# Altium project Due_Breakout_Board.PrjPcb
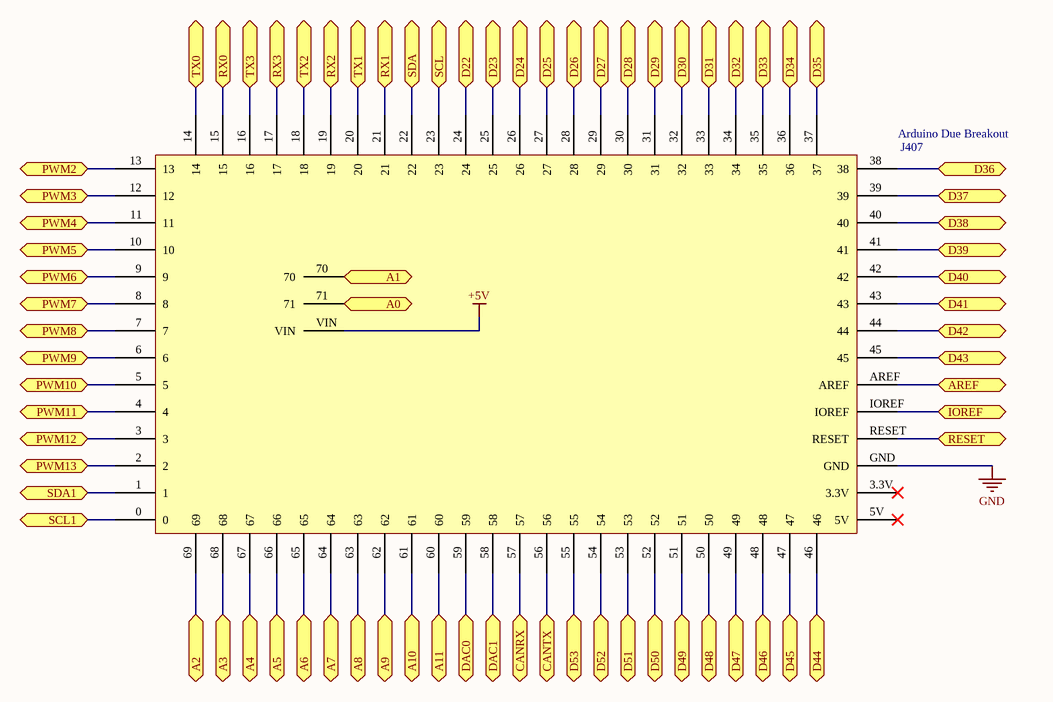
[diagram p0: Due_Breakout_Board.SchDoc]
3 sheets, 39 parts. Net scope: flat (ports and power ports of the same name join across sheets).
Board file: Due_Breakout_Board.PcbDoc
Sheets:
  Due_Breakout_Board.SchDoc
  Due_Breakout_Board Headers.SchDoc
  Due_Breakout_Board supporting circuits.SchDoc

## Sheet Due_Breakout_Board.SchDoc: Due Breakout Board
size A; DocumentNumber: 1; SheetNumber: 1; SheetTotal: 3

### Parts
J407  Arduino Due Breakout  [DUE_BREAKOUT]

### Ports
A0, A1, A2, A3, A4, A5, A6, A7, A8, A9, A10, A11, AREF, CANRX, CANTX, D22, D23, D24, D25, D26, D27, D28, D29, D30, D31, D32, D33, D34, D35, D36, D37, D38, D39, D40, D41, D42, D43, D44, D45, D46, D47, D48, D49, D50, D51, D52, D53, DAC0, DAC1, IOREF, PWM2, PWM3, PWM4, PWM5, PWM6, PWM7, PWM8, PWM9, PWM10, PWM11, PWM12, PWM13, RESET, RX0, RX1, RX2, RX3, SCL, SCL1, SDA, SDA1, TX0, TX1, TX2, TX3

### Nets
+5V: J407.VIN
GND: J407.GND
NetJ401_1: J407.24 ; port D22
NetJ401_2: J407.25 ; port D23
NetJ401_3: J407.26 ; port D24
NetJ401_4: J407.27 ; port D25
NetJ401_5: J407.28 ; port D26
NetJ401_6: J407.29 ; port D27
NetJ401_7: J407.31 ; port D29
NetJ401_8: J407.30 ; port D28
NetJ401_9: J407.71 ; port A0
NetJ401_10: J407.70 ; port A1
NetJ403_3: J407.41 ; port D39
NetJ403_4: J407.42 ; port D40
NetJ403_5: J407.43 ; port D41
NetJ403_6: J407.44 ; port D42
NetJ403_7: J407.45 ; port D43
NetJ403_8: J407.46 ; port D44
NetJ403_9: J407.47 ; port D45
NetJ403_10: J407.48 ; port D46
NetJ403_11: J407.49 ; port D47
NetJ403_12: J407.50 ; port D48
NetJ403_13: J407.51 ; port D49
NetJ403_14: J407.52 ; port D50
NetJ404_1: J407.62 ; port A9
NetJ404_2: J407.61 ; port A10
NetJ404_3: J407.60 ; port A11
NetJ404_4: J407.20 ; port TX1
NetJ404_6: J407.21 ; port RX1
NetJ404_7: J407.64 ; port A7
NetJ404_8: J407.63 ; port A8
NetJ404_10: J407.10 ; port PWM5
NetJ404_11: J407.9 ; port PWM6
NetJ404_12: J407.8 ; port PWM7
NetJ404_13: J407.7 ; port PWM8
NetJ404_14: J407.6 ; port PWM9
NetJ404_15: J407.5 ; port PWM10
NetJ404_16: J407.4 ; port PWM11
NetJ404_17: J407.3 ; port PWM12
NetJ407_0: J407.0 ; port SCL1
NetJ407_1: J407.1 ; port SDA1
NetJ407_2: J407.2 ; port PWM13
NetJ407_11: J407.11 ; port PWM4
NetJ407_12: J407.12 ; port PWM3
NetJ407_13: J407.13 ; port PWM2
NetJ407_14: J407.14 ; port TX0
NetJ407_15: J407.15 ; port RX0
NetJ407_16: J407.16 ; port TX3
NetJ407_17: J407.17 ; port RX3
NetJ407_18: J407.18 ; port TX2
NetJ407_19: J407.19 ; port RX2
NetJ407_22: J407.22 ; port SDA
NetJ407_23: J407.23 ; port SCL
NetJ407_32: J407.32 ; port D30
NetJ407_33: J407.33 ; port D31
NetJ407_34: J407.34 ; port D32
NetJ407_35: J407.35 ; port D33
NetJ407_36: J407.36 ; port D34
NetJ407_37: J407.37 ; port D35
NetJ407_38: J407.38 ; port D36
NetJ407_39: J407.39 ; port D37
NetJ407_40: J407.40 ; port D38
NetJ407_53: J407.53 ; port D51
NetJ407_54: J407.54 ; port D52
NetJ407_55: J407.55 ; port D53
NetJ407_56: J407.56 ; port CANTX
NetJ407_57: J407.57 ; port CANRX
NetJ407_58: J407.58 ; port DAC1
NetJ407_59: J407.59 ; port DAC0
NetJ407_65: J407.65 ; port A6
NetJ407_66: J407.66 ; port A5
NetJ407_67: J407.67 ; port A4
NetJ407_68: J407.68 ; port A3
NetJ407_69: J407.69 ; port A2
NetJ407_AREF: J407.AREF ; port AREF
NetJ407_IOREF: J407.IOREF ; port IOREF
NetJ407_RESET: J407.RESET ; port RESET

Not connected (* = marked no-connect by the designer): J407 3.3V* 5V*

### Notes on the sheet
- Title
- Size:
- Date:
- A
- Number:
- Time:
- Revision:
- Sheet
- of
- File:

### Library data of the parts
J407 = Arduino_Due

## Sheet Due_Breakout_Board Headers.SchDoc: Due Breakout Board Headers
size A; Author: A. Jefferson; DocumentNumber: 2; Revision: A; SheetNumber: 2; SheetTotal: 3
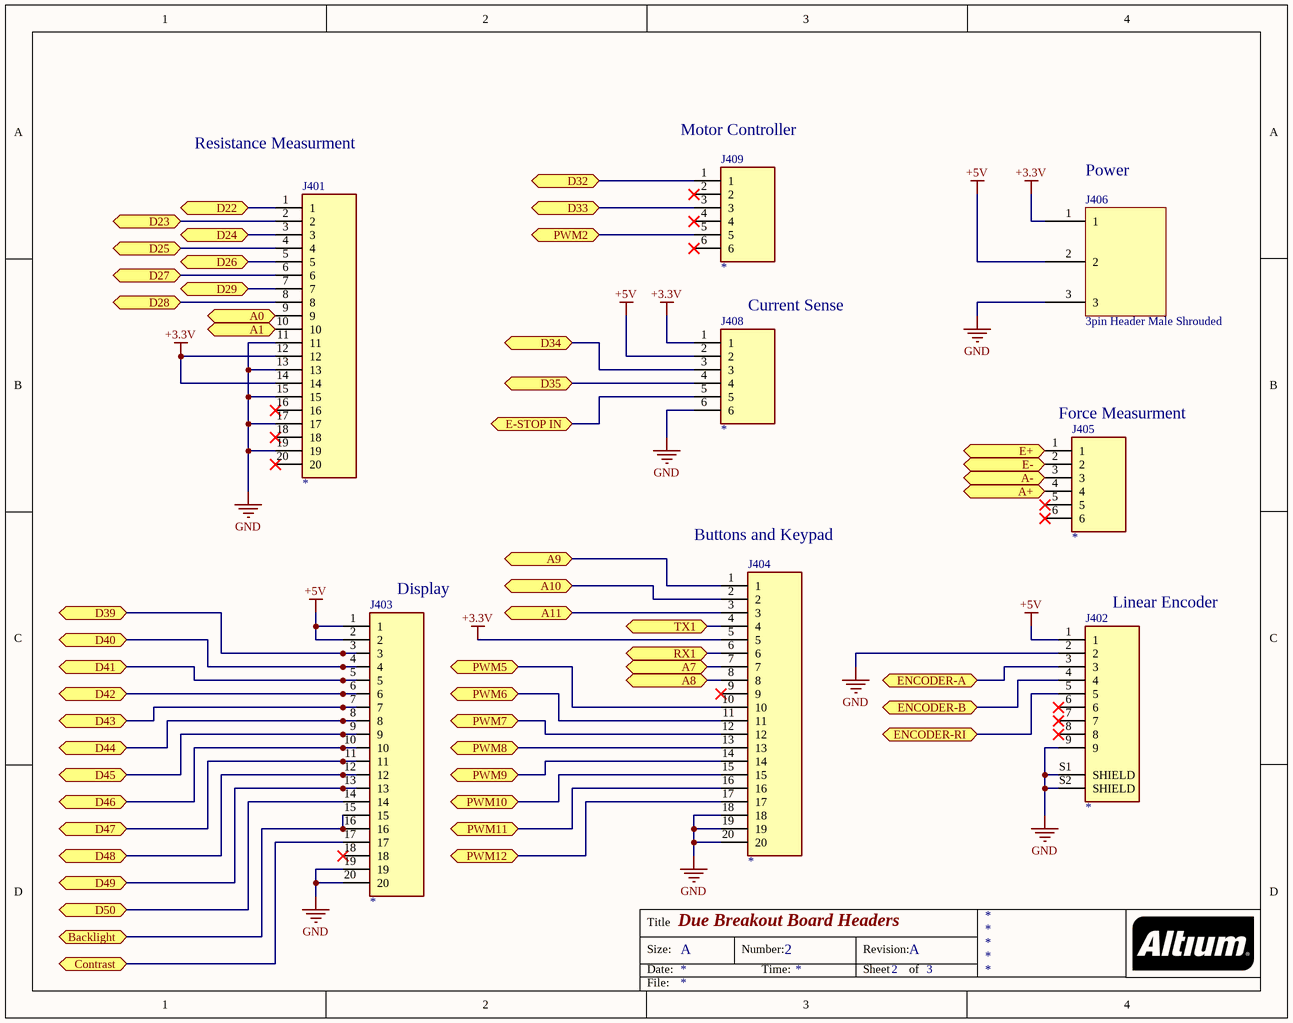
[diagram p1: Due_Breakout_Board Headers.SchDoc]

### Parts
J401  *  [TE_1761681-7]
J402  1-5747150-6  [TE_1-5747150-6]  (value not drawn)
J403  *  [TE_1761681-7]
J404  *  [TE_1761681-7]
J405  *  [TE_1761681-1]
J406  3pin Header Male Shrouded  [3Pin Header]
J408  *  [TE_1761681-1]
J409  *  [TE_1761681-1]

### Ports
A0, A1, A7, A8, A9, A10, A11, A+, A-, Backlight, Contrast, D22, D23, D24, D25, D26, D27, D28, D29, D32, D33, D34, D35, D39, D40, D41, D42, D43, D44, D45, D46, D47, D48, D49, D50, E+, E-, E-STOP IN, ENCODER-A, ENCODER-B, ENCODER-RI, PWM2, PWM5, PWM6, PWM7, PWM8, PWM9, PWM10, PWM11, PWM12, RX1, TX1

### Nets
+3.3V: J401.12 J401.14 J404.5 J406.1 J408.1
+5V: J402.1 J403.1 J403.2 J406.2 J408.2
GND: J401.11 J401.13 J401.15 J401.17 J401.19 J402.2 J402.9 J402.S1(SHIELD) J402.S2(SHIELD) J403.19 J403.20 J404.18 J404.19 J404.20 J406.3 J408.6
NetC401_P: J403.15 J403.16 ; port Backlight
NetJ401_1: J401.1 ; port D22
NetJ401_2: J401.2 ; port D23
NetJ401_3: J401.3 ; port D24
NetJ401_4: J401.4 ; port D25
NetJ401_5: J401.5 ; port D26
NetJ401_6: J401.6 ; port D27
NetJ401_7: J401.7 ; port D29
NetJ401_8: J401.8 ; port D28
NetJ401_9: J401.9 ; port A0
NetJ401_10: J401.10 ; port A1
NetJ402_3: J402.3 ; port ENCODER-A
NetJ402_4: J402.4 ; port ENCODER-B
NetJ402_5: J402.5 ; port ENCODER-RI
NetJ403_3: J403.3 ; port D39
NetJ403_4: J403.4 ; port D40
NetJ403_5: J403.5 ; port D41
NetJ403_6: J403.6 ; port D42
NetJ403_7: J403.7 ; port D43
NetJ403_8: J403.8 ; port D44
NetJ403_9: J403.9 ; port D45
NetJ403_10: J403.10 ; port D46
NetJ403_11: J403.11 ; port D47
NetJ403_12: J403.12 ; port D48
NetJ403_13: J403.13 ; port D49
NetJ403_14: J403.14 ; port D50
NetJ403_17: J403.17 ; port Contrast
NetJ404_1: J404.1 ; port A9
NetJ404_2: J404.2 ; port A10
NetJ404_3: J404.3 ; port A11
NetJ404_4: J404.4 ; port TX1
NetJ404_6: J404.6 ; port RX1
NetJ404_7: J404.7 ; port A7
NetJ404_8: J404.8 ; port A8
NetJ404_10: J404.10 ; port PWM5
NetJ404_11: J404.11 ; port PWM6
NetJ404_12: J404.12 ; port PWM7
NetJ404_13: J404.13 ; port PWM8
NetJ404_14: J404.14 ; port PWM9
NetJ404_15: J404.15 ; port PWM10
NetJ404_16: J404.16 ; port PWM11
NetJ404_17: J404.17 ; port PWM12
NetJ405_1: J405.1 ; port E+
NetJ405_2: J405.2 ; port E-
NetJ405_3: J405.3 ; port A-
NetJ405_4: J405.4 ; port A+
NetJ407_13: J409.5 ; port PWM2
NetJ407_34: J409.1 ; port D32
NetJ407_35: J409.3 ; port D33
NetJ407_36: J408.3 ; port D34
NetJ407_37: J408.4 ; port D35
NetJ408_5: J408.5 ; port E-STOP IN

Not connected (* = marked no-connect by the designer): J401 16* 18* 20*; J402 6* 7* 8*; J403 18*; J404 9*; J405 5* 6*; J409 2* 4* 6*

### Notes on the sheet
- Resistance Measurment
- (near J409) Motor Controller
- (near J406) Power
- Current Sense
- (near J405) Force Measurment
- (near J404) Buttons and Keypad
- (near J403) Display
- (near J402) Linear Encoder
- Title
- Size:
- Date:
- A
- Number:
- Time:
- Revision:
- Sheet
- of
- File:

### Library data of the parts
J401 J403 J404 = 1761681-7: IDC LOW PRO HDR 50P VERT HT BLACK; Package: None; Price: None; Value: *; MP: 1761681-7; Availability: Unavailable
J402 = 1-5747150-6: 9 Position D-Sub Receptacle, Female Sockets Connector; MF: TE Connectivity; Centerline_Pitch: 2.74 mm[.108 in]; Number_of_Positions: 9; Package: None; Price: None; MP: 1-5747150-6; TE_purchase_URL: https://www.te.com/usa-en/product-1-5747150-6.html?te_bu=Cor&te_type=disp&te_campaign=seda_glo_cor-seda-global-disp-prtnr-fy19-seda-model-bom-cta_sma-317_1&elqCampaignId=32493; Availability: Unavailable; Value: *; SnapEDA_Link: https://www.snapeda.com/parts/1-5747150-6/TE%20Connectivity%20AMP%20Connectors/view-part/2374527/?ref=snap; Product_Type: Connector; Comment_1: *
J405 J408 J409 = 1761681-1: MF: {'manufacturer': 'TE Connectivity'}; Package: None; MP: 1761681-1; Price: None; Value: *; Availability: Unavailable

## Sheet Due_Breakout_Board supporting circuits.SchDoc: Due Breakout Board Supporting Circuits
size A; Author: A. Jefferson; Engineer: A. Jefferson; DocumentNumber: 3; Revision: A; SheetNumber: 3; SheetTotal: 3
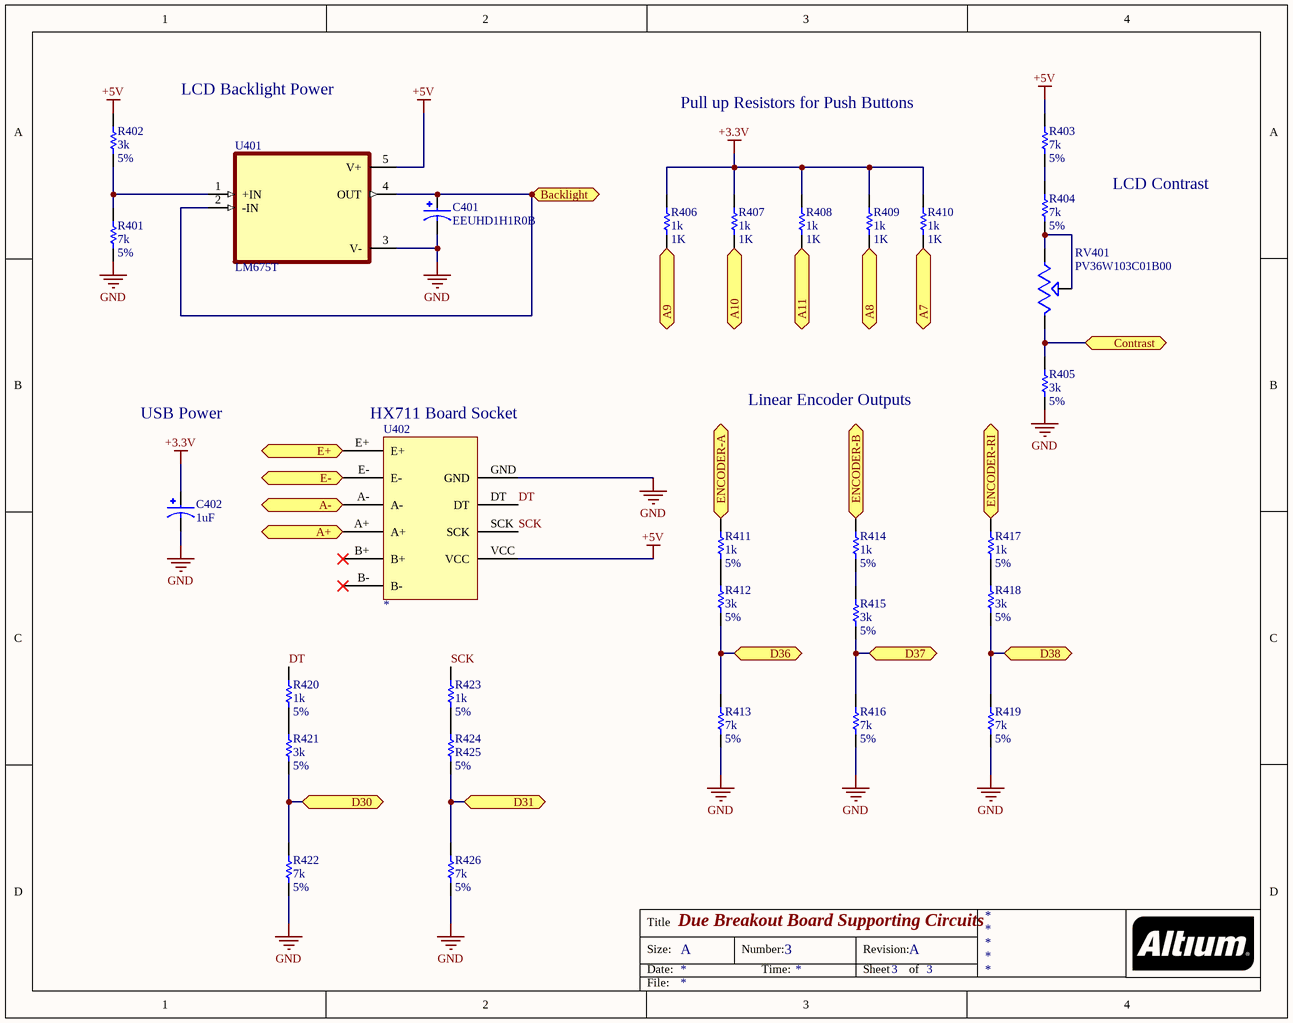
[diagram p2: Due_Breakout_Board supporting circuits.SchDoc]

### Parts
C401  EEUHD1H1R0B  [CAPPRD500W50D500H1100]
C402  1uF  [CAPPRD500W50D500H1100]
R401  7k  value 5%  [AXIAL-0.3]
R402  3k  value 5%  [AXIAL-0.3]
R403  7k  value 5%  [AXIAL-0.3]
R404  7k  value 5%  [AXIAL-0.3]
R405  3k  value 5%  [AXIAL-0.3]
R406  1k  [AXIAL-0.3]
R407  1k  [AXIAL-0.3]
R408  1k  [AXIAL-0.3]
R409  1k  [AXIAL-0.3]
R410  1k  [AXIAL-0.3]
R411  1k  value 5%  [AXIAL-0.3]
R412  3k  value 5%  [AXIAL-0.3]
R413  7k  value 5%  [AXIAL-0.3]
R414  1k  value 5%  [AXIAL-0.3]
R415  3k  value 5%  [AXIAL-0.3]
R416  7k  value 5%  [AXIAL-0.3]
R417  1k  value 5%  [AXIAL-0.3]
R418  3k  value 5%  [AXIAL-0.3]
R419  7k  value 5%  [AXIAL-0.3]
R420  1k  value 5%  [AXIAL-0.3]
R421  3k  value 5%  [AXIAL-0.3]
R422  7k  value 5%  [AXIAL-0.3]
R423  1k  value 5%  [AXIAL-0.3]
R424  R425  value 5%  [AXIAL-0.3]
R426  7k  value 5%  [AXIAL-0.3]
RV401  PV36W103C01B00  [TRIM_PV36W103C01B00]
U401  LM675T  [TO170P1016X470X2092-5]
U402  *  [HX711_MOD]

### Ports
A7, A8, A9, A10, A11, A+, A-, Backlight, Contrast, D30, D31, D36, D37, D38, E+, E-, ENCODER-A, ENCODER-B, ENCODER-RI

### Nets
+3.3V: C402.P R406.2 R407.2 R408.2 R409.1 R410.1
+5V: R402.2 R403.2 U401.5(V+) U402.VCC
GND: C401.N C402.N R401.1 R405.1 R413.1 R416.1 R419.1 R422.1 R426.1 U401.3(V-) U402.GND
DT: R420.2 U402.DT
SCK: R423.2 U402.SCK
NetC401_P: C401.P U401.2(-IN) U401.4(OUT) ; port Backlight
NetJ402_3: R411.2 ; port ENCODER-A
NetJ402_4: R414.2 ; port ENCODER-B
NetJ402_5: R417.2 ; port ENCODER-RI
NetJ403_17: R405.2 RV401.3 ; port Contrast
NetJ404_1: R406.1 ; port A9
NetJ404_2: R407.1 ; port A10
NetJ404_3: R408.1 ; port A11
NetJ404_7: R410.2 ; port A7
NetJ404_8: R409.2 ; port A8
NetJ405_1: U402.E+ ; port E+
NetJ405_2: U402.E- ; port E-
NetJ405_3: U402.A- ; port A-
NetJ405_4: U402.A+ ; port A+
NetJ407_32: R421.1 R422.2 ; port D30
NetJ407_33: R424.1 R426.2 ; port D31
NetJ407_38: R412.1 R413.2 ; port D36
NetJ407_39: R415.1 R416.2 ; port D37
NetJ407_40: R418.1 R419.2 ; port D38
NetR401_2: R401.2 R402.1 U401.1(+IN)
NetR403_1: R403.1 R404.2
NetR404_1: R404.1 RV401.1 RV401.2
NetR411_1: R411.1 R412.2
NetR414_1: R414.1 R415.2
NetR417_1: R417.1 R418.2
NetR420_1: R420.1 R421.2
NetR423_1: R423.1 R424.2

Not connected (* = marked no-connect by the designer): U402 B+* B-*

### Notes on the sheet
- LCD Backlight Power
- Pull up Resistors for Push Buttons
- LCD Contrast
- USB Power
- (near U402) HX711 Board Socket
- Linear Encoder Outputs
- Title
- Size:
- Date:
- A
- Number:
- Time:
- Revision:
- Sheet
- of
- File:

### Library data of the parts
C401 C402 = EEUHD1H1R0B: Cap Aluminum Lytic 1uF 50V 20% (5 X 11mm) Radial 5mm 10mA 1000h 105Â°C Automotive Ammo; MF: Panasonic; Package: RADIAL-2 Panasonic; Price: None; Check_prices: https://www.snapeda.com/parts/EEUHD1H1R0B/Panasonic/view-part/5786221/?ref=eda; Value: *; MP: EEUHD1H1R0B; SnapEDA_Link: https://www.snapeda.com/parts/EEUHD1H1R0B/Panasonic/view-part/5786221/?ref=snap; Availability: In Stock
R401-R424 R426 = Res1: Resistor; Published: 8-Jun-2000; LatestRevisionDate: 17-Jul-2002; LatestRevisionNote: Re-released for DXP Platform.; PackageReference: AXIAL-0.3; Publisher: Altium Limited; PackageDescription: Axial Device, Thru-Hole; 2 Leads; 0.3 in Pin Spacing
  R406-R410: Value: 1K
RV401 = PV36W103C01B00: 10 kOhms 0.5W, 1/2W PC Pins Through Hole Trimmer Potentiometer Cermet 25 Turn Top Adjustment; MF: Bourns; Availability: Unavailable; MP: PV36W103C01B00; Price: None; Value: *; SnapEDA_Link: https://www.snapeda.com/parts/PV36W103C01B00/Bourns/view-part/1439094/?ref=snap; Package: 6332 Bourns
U401 = LM675T: Power Operational Amplifier 5-TO-220 0 to 70; MF: Texas Instruments; Availability: Good; Check_prices: https://www.snapeda.com/parts/LM675T/Texas%20Instruments/view-part/559237/?ref=eda; Value: *; Package: TO-220-5 Texas Instruments; MP: LM675T; Price: None; SnapEDA_Link: https://www.snapeda.com/parts/LM675T/Texas%20Instruments/view-part/559237/?ref=snap; Purchase-URL: https://pricing.snapeda.com/search/part/LM675T/?ref=eda
U402 = HX711_MOD

## Nets that join several sheets
+3.3V: Due_Breakout_Board Headers (5 pins), Due_Breakout_Board supporting circuits (6 pins)
+5V: Due_Breakout_Board (J407.VIN), Due_Breakout_Board Headers (5 pins), Due_Breakout_Board supporting circuits (R402.2 R403.2 U401.5 U402.VCC)
GND: Due_Breakout_Board (J407.GND), Due_Breakout_Board Headers (16 pins), Due_Breakout_Board supporting circuits (11 pins)
NetC401_P: Due_Breakout_Board Headers (J403.15 J403.16), Due_Breakout_Board supporting circuits (C401.P U401.2 U401.4)
NetJ401_1: Due_Breakout_Board (J407.24), Due_Breakout_Board Headers (J401.1)
NetJ401_2: Due_Breakout_Board (J407.25), Due_Breakout_Board Headers (J401.2)
NetJ401_3: Due_Breakout_Board (J407.26), Due_Breakout_Board Headers (J401.3)
NetJ401_4: Due_Breakout_Board (J407.27), Due_Breakout_Board Headers (J401.4)
NetJ401_5: Due_Breakout_Board (J407.28), Due_Breakout_Board Headers (J401.5)
NetJ401_6: Due_Breakout_Board (J407.29), Due_Breakout_Board Headers (J401.6)
NetJ401_7: Due_Breakout_Board (J407.31), Due_Breakout_Board Headers (J401.7)
NetJ401_8: Due_Breakout_Board (J407.30), Due_Breakout_Board Headers (J401.8)
NetJ401_9: Due_Breakout_Board (J407.71), Due_Breakout_Board Headers (J401.9)
NetJ401_10: Due_Breakout_Board (J407.70), Due_Breakout_Board Headers (J401.10)
NetJ402_3: Due_Breakout_Board Headers (J402.3), Due_Breakout_Board supporting circuits (R411.2)
NetJ402_4: Due_Breakout_Board Headers (J402.4), Due_Breakout_Board supporting circuits (R414.2)
NetJ402_5: Due_Breakout_Board Headers (J402.5), Due_Breakout_Board supporting circuits (R417.2)
NetJ403_3: Due_Breakout_Board (J407.41), Due_Breakout_Board Headers (J403.3)
NetJ403_4: Due_Breakout_Board (J407.42), Due_Breakout_Board Headers (J403.4)
NetJ403_5: Due_Breakout_Board (J407.43), Due_Breakout_Board Headers (J403.5)
NetJ403_6: Due_Breakout_Board (J407.44), Due_Breakout_Board Headers (J403.6)
NetJ403_7: Due_Breakout_Board (J407.45), Due_Breakout_Board Headers (J403.7)
NetJ403_8: Due_Breakout_Board (J407.46), Due_Breakout_Board Headers (J403.8)
NetJ403_9: Due_Breakout_Board (J407.47), Due_Breakout_Board Headers (J403.9)
NetJ403_10: Due_Breakout_Board (J407.48), Due_Breakout_Board Headers (J403.10)
NetJ403_11: Due_Breakout_Board (J407.49), Due_Breakout_Board Headers (J403.11)
NetJ403_12: Due_Breakout_Board (J407.50), Due_Breakout_Board Headers (J403.12)
NetJ403_13: Due_Breakout_Board (J407.51), Due_Breakout_Board Headers (J403.13)
NetJ403_14: Due_Breakout_Board (J407.52), Due_Breakout_Board Headers (J403.14)
NetJ403_17: Due_Breakout_Board Headers (J403.17), Due_Breakout_Board supporting circuits (R405.2 RV401.3)
NetJ404_1: Due_Breakout_Board (J407.62), Due_Breakout_Board Headers (J404.1), Due_Breakout_Board supporting circuits (R406.1)
NetJ404_2: Due_Breakout_Board (J407.61), Due_Breakout_Board Headers (J404.2), Due_Breakout_Board supporting circuits (R407.1)
NetJ404_3: Due_Breakout_Board (J407.60), Due_Breakout_Board Headers (J404.3), Due_Breakout_Board supporting circuits (R408.1)
NetJ404_4: Due_Breakout_Board (J407.20), Due_Breakout_Board Headers (J404.4)
NetJ404_6: Due_Breakout_Board (J407.21), Due_Breakout_Board Headers (J404.6)
NetJ404_7: Due_Breakout_Board (J407.64), Due_Breakout_Board Headers (J404.7), Due_Breakout_Board supporting circuits (R410.2)
NetJ404_8: Due_Breakout_Board (J407.63), Due_Breakout_Board Headers (J404.8), Due_Breakout_Board supporting circuits (R409.2)
NetJ404_10: Due_Breakout_Board (J407.10), Due_Breakout_Board Headers (J404.10)
NetJ404_11: Due_Breakout_Board (J407.9), Due_Breakout_Board Headers (J404.11)
NetJ404_12: Due_Breakout_Board (J407.8), Due_Breakout_Board Headers (J404.12)
NetJ404_13: Due_Breakout_Board (J407.7), Due_Breakout_Board Headers (J404.13)
NetJ404_14: Due_Breakout_Board (J407.6), Due_Breakout_Board Headers (J404.14)
NetJ404_15: Due_Breakout_Board (J407.5), Due_Breakout_Board Headers (J404.15)
NetJ404_16: Due_Breakout_Board (J407.4), Due_Breakout_Board Headers (J404.16)
NetJ404_17: Due_Breakout_Board (J407.3), Due_Breakout_Board Headers (J404.17)
NetJ405_1: Due_Breakout_Board Headers (J405.1), Due_Breakout_Board supporting circuits (U402.E+)
NetJ405_2: Due_Breakout_Board Headers (J405.2), Due_Breakout_Board supporting circuits (U402.E-)
NetJ405_3: Due_Breakout_Board Headers (J405.3), Due_Breakout_Board supporting circuits (U402.A-)
NetJ405_4: Due_Breakout_Board Headers (J405.4), Due_Breakout_Board supporting circuits (U402.A+)
NetJ407_13: Due_Breakout_Board (J407.13), Due_Breakout_Board Headers (J409.5)
NetJ407_32: Due_Breakout_Board (J407.32), Due_Breakout_Board supporting circuits (R421.1 R422.2)
NetJ407_33: Due_Breakout_Board (J407.33), Due_Breakout_Board supporting circuits (R424.1 R426.2)
NetJ407_34: Due_Breakout_Board (J407.34), Due_Breakout_Board Headers (J409.1)
NetJ407_35: Due_Breakout_Board (J407.35), Due_Breakout_Board Headers (J409.3)
NetJ407_36: Due_Breakout_Board (J407.36), Due_Breakout_Board Headers (J408.3)
NetJ407_37: Due_Breakout_Board (J407.37), Due_Breakout_Board Headers (J408.4)
NetJ407_38: Due_Breakout_Board (J407.38), Due_Breakout_Board supporting circuits (R412.1 R413.2)
NetJ407_39: Due_Breakout_Board (J407.39), Due_Breakout_Board supporting circuits (R415.1 R416.2)
NetJ407_40: Due_Breakout_Board (J407.40), Due_Breakout_Board supporting circuits (R418.1 R419.2)